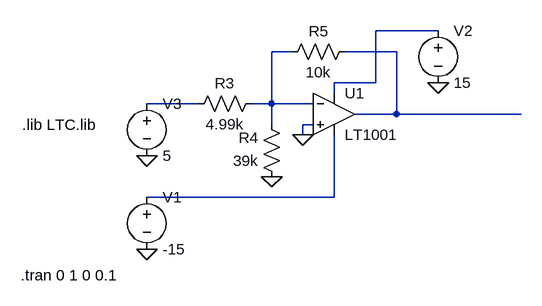
[diagram p0: schematic VCF CV gain.asc]
VCF CV gain.asc, the LTspice schematic file:
Version 4
SHEET 1 880 680
WIRE 496 16 400 16
WIRE 272 48 240 48
WIRE 432 48 352 48
WIRE 400 96 400 16
WIRE 400 96 336 96
WIRE 336 112 336 96
WIRE 128 128 48 128
WIRE 240 128 240 48
WIRE 240 128 208 128
WIRE 304 128 240 128
WIRE 432 144 432 48
WIRE 432 144 368 144
WIRE 624 144 432 144
WIRE 240 160 240 128
WIRE 304 160 288 160
WIRE 288 176 288 160
WIRE 336 272 336 176
WIRE 336 272 48 272
FLAG 240 240 0
FLAG 48 352 0
FLAG 496 96 0
FLAG 48 208 0
FLAG 288 176 0
SYMBOL res 224 112 R90
WINDOW 0 0 56 VBottom 2
WINDOW 3 32 56 VTop 2
SYMATTR InstName R3
SYMATTR Value 4.99k
SYMBOL res 256 256 R180
WINDOW 0 36 76 Left 2
WINDOW 3 36 40 Left 2
SYMATTR InstName R4
SYMATTR Value 39k
SYMBOL res 256 64 R270
WINDOW 0 32 56 VTop 2
WINDOW 3 0 56 VBottom 2
SYMATTR InstName R5
SYMATTR Value 10k
SYMBOL Opamps\\LT1001 336 80 R0
SYMATTR InstName U1
SYMBOL voltage 48 256 R0
WINDOW 123 0 0 Left 2
WINDOW 39 0 0 Left 2
SYMATTR InstName V1
SYMATTR Value -15
SYMBOL voltage 496 0 R0
WINDOW 123 0 0 Left 2
WINDOW 39 0 0 Left 2
SYMATTR InstName V2
SYMATTR Value 15
SYMBOL voltage 48 112 R0
WINDOW 123 0 0 Left 2
WINDOW 39 0 0 Left 2
SYMATTR InstName V3
SYMATTR Value 5
TEXT -144 160 Left 2 !.lib LTC.lib
TEXT -146 392 Left 2 !.tran 0 1 0 0.1

The netlist it stands for:
* VCF CV gain.asc
R3 N002 N004 4.99k
R4 0 N002 39k
R5 N002 N003 10k
XU1 0 N002 N001 N005 N003 LT1001  ; pins In+ In- V+ V- OUT
V1 N005 0 -15
V2 N001 0 15
V3 N004 0 5
.lib LTC.lib
.tran 0 1 0 0.1
.lib LTC.lib
.backanno
.end